# Altium project Timebase board.PrjPcb
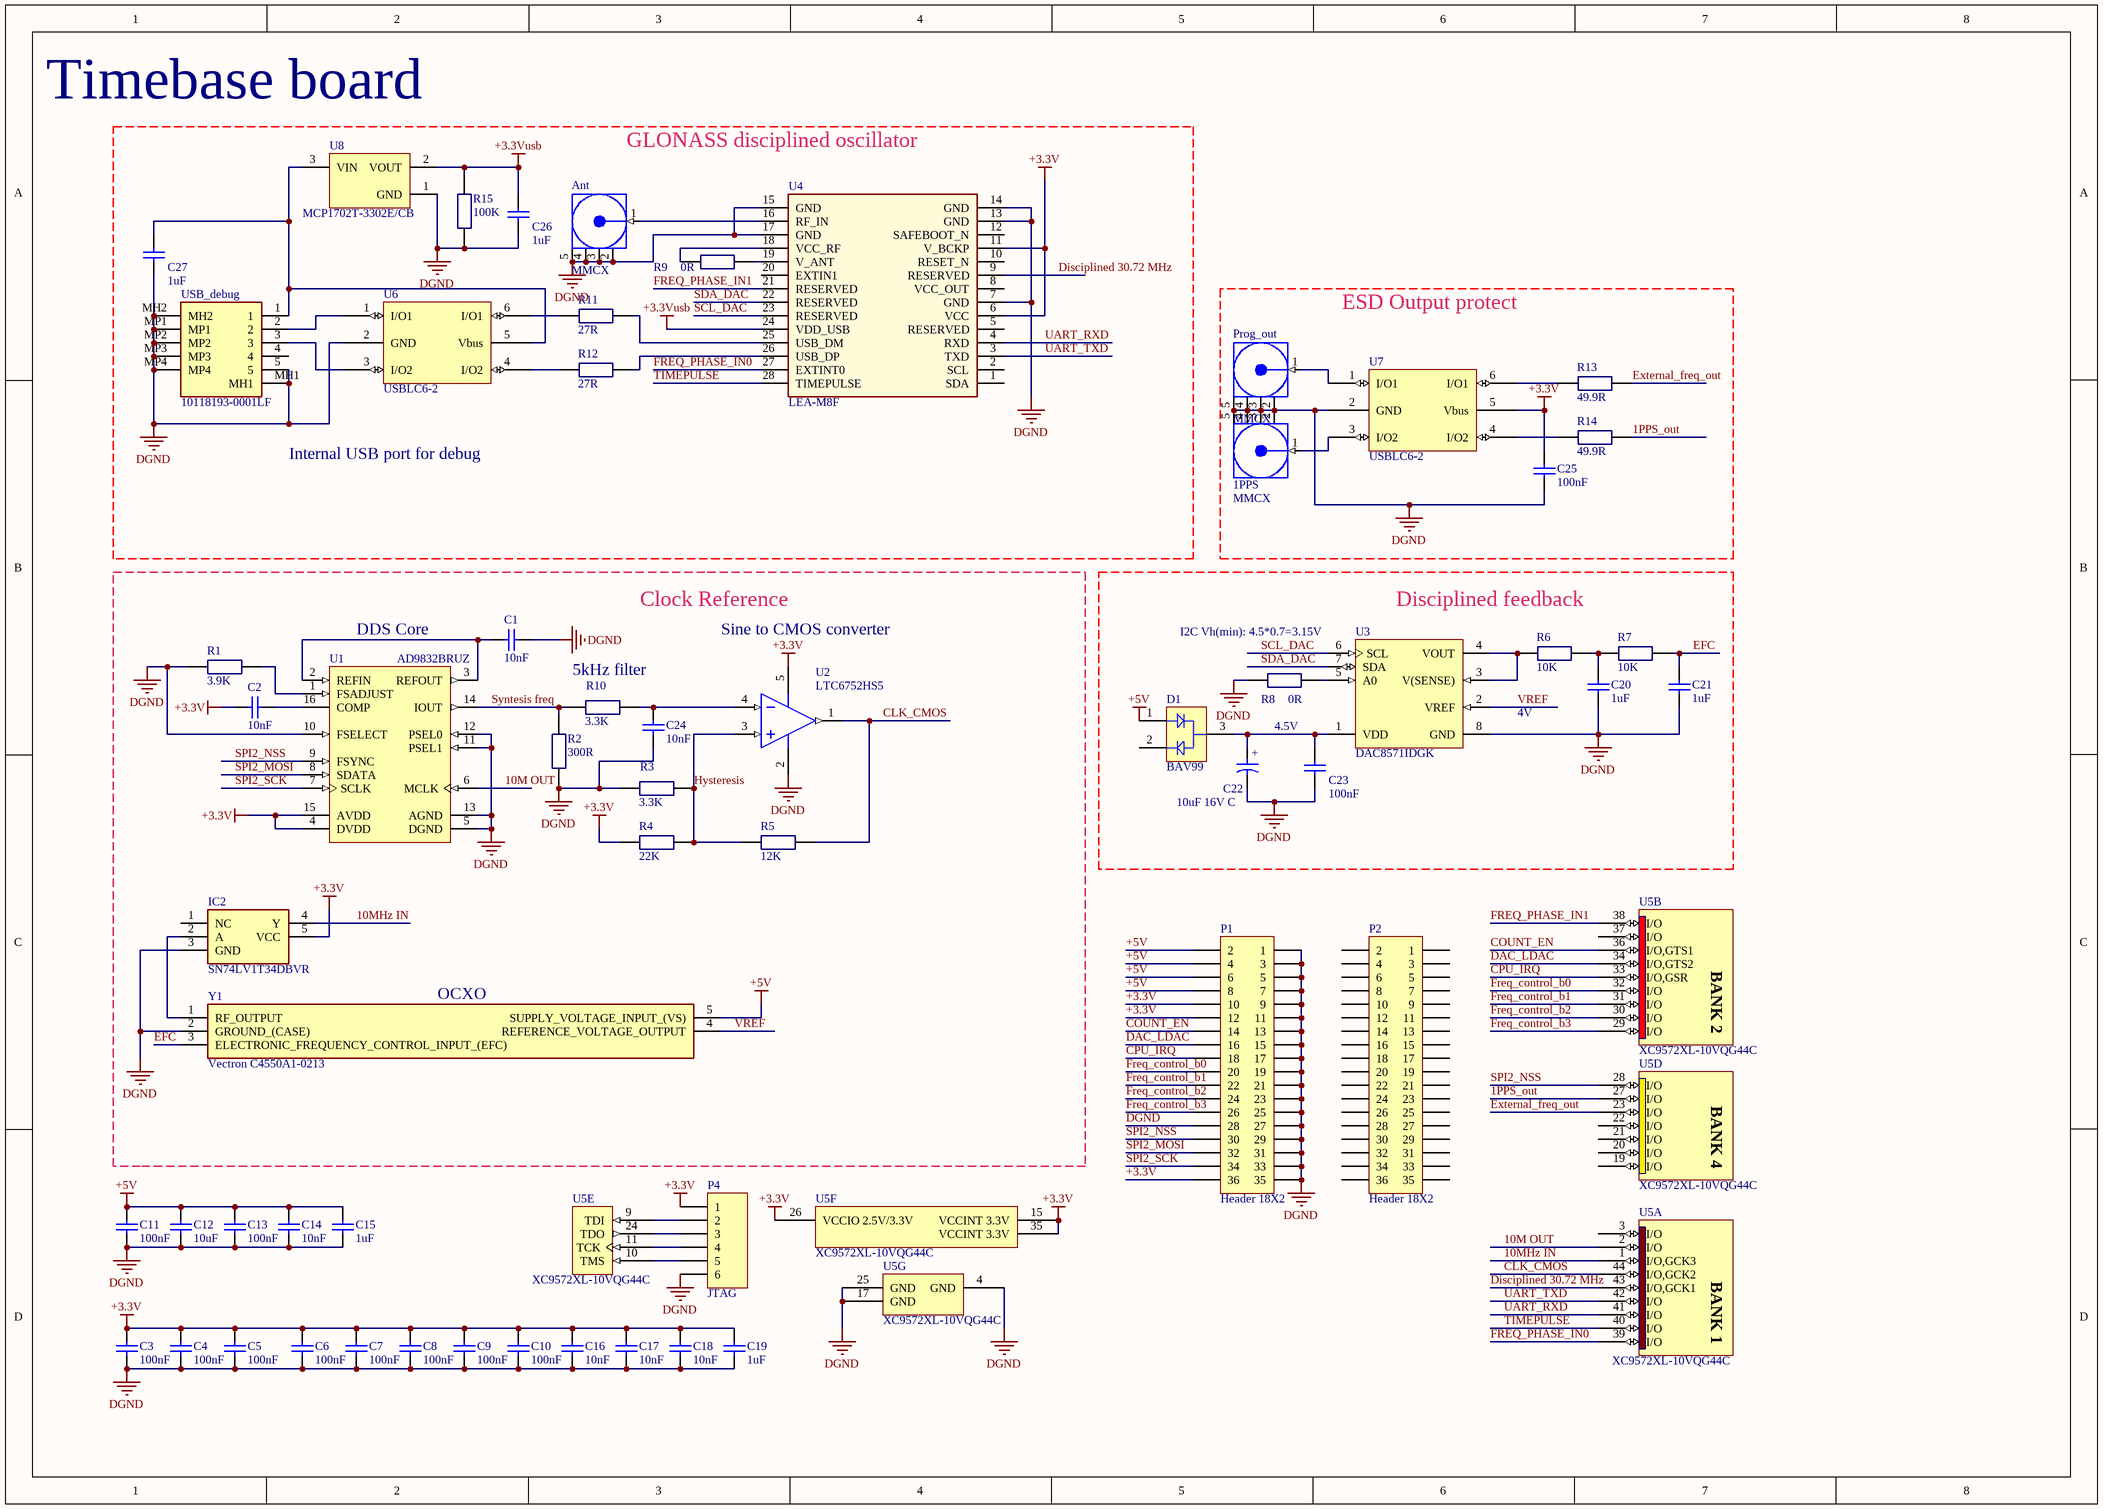
[diagram p0: Timebase_shcematics.SchDoc]
1 sheet, 60 parts. Net scope: global (net labels, ports and power ports of the same name join across sheets).
Board file: Timebase_PCB.PcbDoc

## Sheet Timebase_shcematics.SchDoc: Ultra-Precision low speed ramp generator for low current calibration
size A3; PageSetup: Record=PageOptions|CenterHorizontal=True|CenterVertical=True|PrintScale=0.52|XCorrection=1.00|YCorrection=1.00|PrintKind=0|BorderSize=5000000|LeftOffset=0|BottomOffset=0|Orientation=2|PaperLength=1000|PaperWidth=1000|Scale=100|PaperSource=7|PrintQuality=-3|MediaType=1|DitherType=10|PrintScaleMode=1|PaperKind=A4|PaperIndex=9

### Parts
1PPS  MMCX  [MMCX2.54-V5]
Ant  MMCX  [MMCX2.54-V5]
C1  10nF  [CAP 0603]
C2  10nF  [CAP 0603]
C3  100nF  [CAP 0603]
C4  100nF  [CAP 0603]
C5  100nF  [CAP 0603]
C6  100nF  [CAP 0603]
C7  100nF  [CAP 0603]
C8  100nF  [CAP 0603]
C9  100nF  [CAP 0603]
C10  100nF  [CAP 0603]
C11  100nF  [CAP 0603]
C12  10uF  [CAP 0603]
C13  100nF  [CAP 0603]
C14  10nF  [CAP 0603]
C15  1uF  [CAP 0603]
C16  10nF  [CAP 0603]
C17  10nF  [CAP 0603]
C18  10nF  [CAP 0603]
C19  1uF  [CAP 0603]
C20  1uF  [CAP 0603]
C21  1uF  [CAP 0603]
C22  10uF 16V C  [CAPMP6032X280N]
C23  100nF  [CAP 0603]
C24  10nF  [CAP 0603]
C25  100nF  [CAP 0603]
C26  1uF  [CAP 0603]
C27  1uF  [CAP 0603]
D1  BAV99  [INF-SOT23_N]
IC2  SN74LV1T34DBVR  [SOT95P280X145-5N]
P1  Header 18X2  [HDR2X18]
P2  Header 18X2  [HDR2X18]
P4  JTAG  [HDR1X6]
Prog_out  MMCX  [MMCX2.54-V5]
R1  3.9K  [1608[0603]]
R2  300R  [Yegeo 0603]
R3  3.3K  [Yegeo 0603]
R4  22K  [Yegeo 0603]
R5  12K  [Yegeo 0603]
R6  10K  [1608[0603]]
R7  10K  [1608[0603]]
R8  0R  [1608[0603]]
R9  0R  [1608[0603]]
R10  3.3K  [Yegeo 0603]
R11  27R  [1608[0603]]
R12  27R  [1608[0603]]
R13  49.9R  [1608[0603]]
R14  49.9R  [1608[0603]]
R15  100K  [1608[0603]]
U1  AD9832BRUZ  [ADI-RU-16_N]
U2  LTC6752HS5  [TI-DBV5_N]
U3  DAC8571IDGK  [TI-DGK8_N]
U4  LEA-M8F  [LEA]
U5  XC9572XL-10VQG44C  [VQG44_N]  (parts A,B,D,E,F,G of 7)
U6  USBLC6-2  [SOT23-6L]
U7  USBLC6-2  [SOT23-6L]
U8  MCP1702T-3302E/CB  [SOT-23A-CB3_N]
USB_debug  10118193-0001LF  [101181930001LF]
Y1  Vectron C4550A1-0213  [C4550C508SV120RFSA11128MHZ]

### Blocks framed on the sheet
GLONASS disciplined oscillator: Ant C26 C27 R9 R11 R12 R15 U4 U6 U8 USB_debug
ESD Output protect: 1PPS C25 Prog_out R13 R14 U7
Clock Reference: C1 C2 C24 IC2 R1-R5 R10 U1 U2 Y1
Disciplined feedback: C20-C23 D1 R6-R8 U3

### Nets
+3.3V: C2.1 C3.2 C4.2 C5.2 C6.2 C7.2 C8.2 C9.2 C10.2 C16.2 C17.2 C18.2 C19.2 C25.2 IC2.5(VCC) P1.10 P1.12 P1.36 P4.1 R4.2 U1.4(DVDD) U1.15(AVDD) U2.5(V+) U4.6(VCC) U4.11(V_BCKP) U5.15(VCCINT_3.3V) U5.26(VCCIO_2.5V/3.3V) U5.35(VCCINT_3.3V) U7.5(Vbus)
+3.3Vusb: C26.2 R15.1(A) U4.24(VDD_USB) U8.2(VOUT)
+5V: C11.2 C12.2 C13.2 C14.2 C15.2 D1.1(A1) P1.2 P1.4 P1.6 P1.8 Y1.5(SUPPLY_VOLTAGE_INPUT_(VS))
DGND: 1PPS.2(GND) 1PPS.3(GND) 1PPS.4(GND) 1PPS.5(GND) Ant.2(GND) Ant.3(GND) Ant.4(GND) Ant.5(GND) C1.2 C3.1 C4.1 C5.1 C6.1 C7.1 C8.1 C9.1 C10.1 C11.1 C12.1 C13.1 C14.1 C15.1 C16.1 C17.1 C18.1 C19.1 C20.1 C21.1 C22.2 C23.1 C24.1 C25.1 C26.1 C27.1 IC2.3(GND) P1.1 P1.3 P1.5 P1.7 P1.9 P1.11 P1.13 P1.15 P1.17 P1.19 P1.21 P1.23 P1.25 P1.27 P1.28 P1.29 P1.31 P1.33 P1.35 P4.6 Prog_out.2(GND) Prog_out.3(GND) Prog_out.4(GND) Prog_out.5(GND) R1.2 R2.1(A) R3.2 R8.2 R15.2 U1.5(DGND) U1.10(FSELECT) U1.11(PSEL1) U1.12(PSEL0) U1.13(AGND) U2.2(V-) U3.8(GND) U4.7(GND) U4.13(GND) U4.14(GND) U4.15(GND) U4.17(GND) U5.4(GND) U5.17(GND) U5.25(GND) U6.2(GND) U7.2(GND) U8.1(GND) USB_debug.5 USB_debug.MH1 USB_debug.MH2 USB_debug.MP1 USB_debug.MP2 USB_debug.MP3 USB_debug.MP4 Y1.2(GROUND_(CASE))
1PPS_out: R14.1(A) U5.27(I/O)
10M OUT: U1.6(MCLK) U5.2(I/O)
10MHz IN: IC2.4(Y) U5.1(I/O,GCK3)
CLK_CMOS: R5.1(A) U2.1(OUT) U5.44(I/O,GCK2)
COUNT_EN: P1.14 U5.36(I/O,GTS1)
CPU_IRQ: P1.18 U5.33(I/O,GSR)
DAC_LDAC: P1.16 U5.34(I/O,GTS2)
Disciplined 30.72 MHz: U4.9(RESERVED) U5.43(I/O,GCK1)
EFC: C21.2 R7.1(A) Y1.3(ELECTRONIC_FREQUENCY_CONTROL_INPUT_(EFC))
External_freq_out: R13.1(A) U5.23(I/O)
Freq_control_b0: P1.20 U5.32(I/O)
Freq_control_b1: P1.22 U5.31(I/O)
Freq_control_b2: P1.24 U5.30(I/O)
Freq_control_b3: P1.26 U5.29(I/O)
FREQ_PHASE_IN0: U4.27(EXTINT0) U5.39(I/O)
FREQ_PHASE_IN1: U4.21(RESERVED) U5.38(I/O)
Hysteresis: R3.1(A) R4.1(A) R5.2 U2.3(IN+)
SCL_DAC: U3.6(SCL) U4.23(RESERVED)
SDA_DAC: U3.7(SDA) U4.22(RESERVED)
SPI2_MOSI: P1.32 U1.8(SDATA)
SPI2_NSS: P1.30 U1.9(FSYNC) U5.28(I/O)
SPI2_SCK: P1.34 U1.7(SCLK)
Syntesis freq: R2.2 R10.2 U1.14(IOUT)
TIMEPULSE: U4.28(TIMEPULSE) U5.40(I/O)
UART_RXD: U4.4(RXD) U5.41(I/O)
UART_TXD: U4.3(TXD) U5.42(I/O)
VREF: U3.2(VREF) Y1.4(REFERENCE_VOLTAGE_OUTPUT)
Net1PPS_1: 1PPS.1(Signal) U7.3(I/O2)
NetAnt_1: Ant.1(Signal) U4.16(RF_IN)
NetC1_1: C1.1 U1.2(REFIN) U1.3(REFOUT)
NetC2_2: C2.2 U1.16(COMP)
NetC20_2: C20.2 R6.1(A) R7.2
NetC22_1: C22.1 C23.2 D1.3(C) U3.1(VDD)
NetC24_2: C24.2 R10.1(A) U2.4(IN-)
NetC27_2: C27.2 U6.5(Vbus) U8.3(VIN) USB_debug.1
NetIC2_2: IC2.2(A) Y1.1(RF_OUTPUT)
NetP4_2: P4.2 U5.9(TDI)
NetP4_3: P4.3 U5.24(TDO)
NetP4_4: P4.4 U5.11(TCK)
NetP4_5: P4.5 U5.10(TMS)
NetProg_out_1: Prog_out.1(Signal) U7.1(I/O1)
NetR1_1: R1.1(A) U1.1(FSADJUST)
NetR6_2: R6.2 U3.3(V(SENSE)) U3.4(VOUT)
NetR8_1: R8.1(A) U3.5(A0)
NetR9_1: R9.1(A) U4.19(V_ANT)
NetR9_2: R9.2 U4.18(VCC_RF)
NetR11_1: R11.1(A) U4.25(USB_DM)
NetR11_2: R11.2 U6.6(I/O1)
NetR12_1: R12.1(A) U4.26(USB_DP)
NetR12_2: R12.2 U6.4(I/O2)
NetR13_2: R13.2 U7.6(I/O1)
NetR14_2: R14.2 U7.4(I/O2)
NetU6_1: U6.1(I/O1) USB_debug.2
NetU6_3: U6.3(I/O2) USB_debug.3

Not connected (* = marked no-connect by the designer): D1 2(K2); IC2 1(NC); P2 1 2 3 4 5 6 7 8 9 10 11 12 13 14 15 16 17 18 19 20 21 22 23 24 25 26 27 28 29 30 31 32 33 34 35 36; U4 1(SDA) 2(SCL) 5(RESERVED) 8(VCC_OUT) 10(RESET_N) 12(SAFEBOOT_N) 20(EXTIN1); U5 3(I/O) 19(I/O) 20(I/O) 21(I/O) 22(I/O) 37(I/O); USB_debug 4

### Notes on the sheet
- Timebase board
- Internal USB port for debug
- (near U1) DDS Core
- Sine to CMOS converter
- (near U3) I2C Vh(min): 4.5*0.7=3.15V
- 5kHz filter
- 4V
- 4.5V
- (near Y1) OCXO
- (in symbol CTE6032-28_10UF_25V_10%_LESR0500) +
- (in symbol XC9572XL-10VQG44C, part A) BANK 1
- (in symbol XC9572XL-10VQG44C, part B) BANK 2
- (in symbol XC9572XL-10VQG44C, part D) BANK 4

### Library data of the parts
1PPS Ant Prog_out = COAX-M: RF Coaxial PCB Connector, MMCX; Thru-Hole, Vertical Mount Plug,  50 Ohm Impedance; PackageDocument: Rev. A, 16-Jun-1997; PCB_Layout: Complies with manufacturer's recommendation.; DrillSize: Corresponds to nominal value.; Published: 15-Jul-2004; LatestRevisionDate: 15-Jul-2004; LatestRevisionNote: Component Replaced.; DatasheetDocument: 30-May-2003; PackageReference: 908-21103; Publisher: Altium Limited; ComponentLink1Description: Manufacturer Link; ComponentLink1URL: http://www.amphenolrf.com/
C1-C21 C23-C27 = Cap Semi: Capacitor (Semiconductor SIM Model); Order: CC0603KRX7R8BB104; Published: 8-Jun-2000; LatestRevisionDate: 29-May-2009; LatestRevisionNote: IPC-7351 Footprint Added.; PackageReference: C1206; Publisher: Altium Limited; PackageDescription: Chip Capacitor
  C1 C2 C14 C16-C18 C24: Value: 10nF
  C3-C11 C13 C23 C25: Value: 100nF
  C12: Value: 10uF
  C15 C19-C21 C26 C27: Value: 1uF
C22 = CTE6032-28_10UF_25V_10%_LESR0500: Polarised capacitor; Part Description: Low ESR 0R5 Solid Tantalum Chip Capacitor; Manufacturer: GENERIC; Manufacturer1 Part Number: TPSC106K025R0500; Voltage: 25V; Tolerance: ±10%; Part Number: CTE6032-28_10UF_25V_10%_LESR0500; Component Kind: Standard; Component Type: Standard; Pin Count: 2; Value: 10uF 16V C; Status: Preferred; Manufacturer Part Number: CTE6032-28_10UF_25V_10%_LESR0500; Case: C; Mounted: Yes; Socket: No; SMD: Yes; Sense: No; Manufacturer1 Example: AVX; Manufacturer1 ComponentHeight: 2.8mm; HelpURL: \\cern.ch\dfs\Applications\Altium\Datasheets\CTE-LESR_AVX_TPS.pdf; Author: CERN DEM JLC; CreateDate: 05.05.2008; LatestRevisionDate: 20.01.2009
D1 = BAV99: Silicon Switching Diode, SOT23, Reel, Green; Manufacturer: Infineon; Green: TRUE; PackageVersion: Apr-08; PackageReference: SOT23; PackageDescription: 3-Pin Small Outline Transistor Package, 1.3 x 2.9 mm Body, 0.95 mm Pitch; Supplier 1: Arrow; Supplier Part Number 1: 8_hDx09NysxyY_EZJdaSbs5L1p9U5ut-2MaZMQWGOaA; Supplier 2: Farnell; Supplier Part Number 2: 1056504RL; Supplier 3: Farnell; Supplier Part Number 3: 1056504; Packing: Reel; Mounting Technology: Surface Mount; PartNumber: BAV99; ComponentLink1Description: Manufacturer URL; ComponentLink1URL: http://www.infineon.com/; ComponentLink2Description: Datasheet; ComponentLink2URL: http://www.infineon.com/dgdl/bav99series.pdf?folderId=db3a30431400ef6801141b5844e103ea&fileId=db3a30431400ef6801141c1b237d042f; ComponentLink3Description: Package Specification; ComponentLink3URL: http://www.infineon.com/dgdl/smbta14_mmbta14.pdf?folderId=db3a30431441fb5d011445c30f210183&fileId=db3a30431441fb5d011445ef0201018c
IC2 = SN74LV1T34DBVR: Integrated Circuit; Manufacturer_Name: Texas Instruments; Datasheet Link: http://www.ti.com/lit/gpn/sn74lv1t34; Height: 1.45mm; Manufacturer_Part_Number: SN74LV1T34DBVR; Mouser Part Number: 595-SN74LV1T34DBVR; Mouser Price/Stock: https://www.mouser.co.uk/ProductDetail/Texas-Instruments/SN74LV1T34DBVR?qs=8sOby8ZxZLE4ekkxA3S6Wg%3D%3D; Arrow Part Number: SN74LV1T34DBVR; Arrow Price/Stock: https://www.arrow.com/en/products/sn74lv1t34dbvr/texas-instruments?region=nac
P1 P2 = Header 18X2: Header, 18-Pin, Dual row; System: Connector; LatestRevisionDate: 17-Jul-2002; LatestRevisionNote: Re-released for DXP Platform.; Publisher: Altium Limited
P4 = Header 6: Header, 6-Pin; LatestRevisionDate: 17-Jul-2002; LatestRevisionNote: Re-released for DXP Platform.; Publisher: Altium Limited
R1-R5 R10 = Resistor 0805: Order: ERA-3AEB49R9V; Avail: 20
  R1: Value: 3.9K
  R2: Value: 300R
  R3 R10: Value: 3.3K
  R4: Value: 22K
  R5: Value: 12K
R6-R9 R11-R15 = Resistor 0805: Order: CR0603-JW-220GLF; Avail: 20
  R6 R7: Value: 10K
  R8 R9: Value: 0R
  R11 R12: Value: 27R
  R13 R14: Value: 49.9R
  R15: Value: 100K
U1 = AD9832BRUZ: 25 MHz Direct Digital Synthesizer, Waveform Generator, 10-Bit, Serial, RU-16, 96 Tube, Pb-Free; Master fclk: 25MHz; Resolution (Bits): 10bit; Tuning Word Width (bits): 32bit; REFCLK Multiplier: No; Compliance Range (V): 1.35V; FS Iout (mA nom): 4mA; I Supply total (max): 15mA; DatasheetVersion: Rev. C; PackageVersion: Nov-2002; PackageReference: RU-16; PackageDescription: 16-Lead Thin Shrink Small Outline Package [TSSOP]; I/O Interface: Serial; Code_JEDEC: MO-153AB; ComponentLink1Description: Manufacturer URL; ComponentLink1URL: www.analog.com; ComponentLink2Description: Datasheet; ComponentLink2URL: http://www.analog.com/static/imported-files/data_sheets/AD9832.pdf; ComponentLink3Description: Package Specification; ComponentLink3URL: http://www.analog.com/static/imported-files/packages/36244347913743854010197452789RU16.pdf
U2 = OPA353NA/250: High-Speed, Single-Supply, Rail-to-Rail Operational Amplifier MicroAmplifier(TM) Series, 2.7 to 5.5 V, -40 to 85 degC, 5-pin SOT23 (DBV5), Green (RoHS & no Sb/Br); Manufacturer: Texas Instruments; CMRR(Min)(dB): 76; GBW(Typ)(MHz): 44; IIB(Max)(pA): 10; Iq per channel(Max)(mA): 8; Number of Channels: 1; Offset Drift(Typ)(uV/C): 5; Packing: SMALL T&R; Rating: Catalog; Slew Rate(Typ)(V/us): 22; Sub Family: High Output Current Amplifier (>=50mA), Low Input Bias Current Amp (<=10pA), Low Supply Voltage Amplifier (<=2.7V), Precision Amplifier; Total Supply Voltage(Max)(+5V is 5, +/-5V is 10): 5.5; Total Supply Voltage(Min)(+5V is 5, +/-5V is 10): 2.7; DatasheetVersion: SBOS103; PackageVersion: 4073253-4/K, 03/2006; PackageReference: DBV5; PackageDescription: 5-Pin Plastic Small Outline, Body 1.6 x 2.9 mm, Pitch 0.95 mm; Supplier 1: Digi-Key; Supplier Part Number 1: OPA353NATR-ND; Supplier 2: Digi-Key; Supplier Part Number 2: OPA353NACT-ND; Supplier 3: Digi-Key; Supplier Part Number 3: OPA353NADKR-ND; Supplier 4: Farnell; Supplier Part Number 4: 1207049; Supplier 5: Farnell; Supplier Part Number 5: 1207049RL; Supplier 6: Newark; Supplier Part Number 6: 35C1895; Supplier 7: Mouser; Supplier Part Number 7: 595-OPA353NA/250; Eco-Plan: Green (RoHS & no Sb/Br); Vio (25C)(Max)(mV): 8; Mounting Technology: Surface Mount; Code_JEDEC: MO-178; PartNumber: OPA353NA/250; ComponentLink1Description: Manufacturer URL; ComponentLink1URL: http://www.ti.com/; ComponentLink2Description: Datasheet; ComponentLink2URL: http://www.ti.com/lit/ds/symlink/opa353.pdf; ComponentLink3Description: Package Specification; ComponentLink3URL: http://www.ti.com/litv/pdf/mpds018i
U3 = DAC8571IDGK: Low-Power Rail-to-Rail Output 16-Bit I2C Input DAC, -40 to 105 degC, 8-pin SOP (DGK8), Green (RoHS & no Sb/Br); Manufacturer: Texas Instruments; DAC Channels: 1; INL(Max)(+/-LSB): 65; Interface: Serial I2C; Power Consumption(Typ)(mW): 0.42; Resolution(Bits): 16; Settling Time(us): 8; SubFamily: Precision DAC (=<10MSPS); DatasheetVersion: SLAS373A; PackageVersion: 4073329/E, 05/2006; PackageReference: DGK8; PackageDescription: 8-Pin Thin Small Outline, Body 3 x 3 mm, Pitch 0.65 mm; Supplier 1: Digi-Key; Supplier Part Number 1: 296-26051-5-ND; Supplier 2: Newark; Supplier Part Number 2: 20H5068; Supplier 3: Mouser; Supplier Part Number 3: 595-DAC8571IDGK; DNL(Max)(+/-LSB): 1; Eco-Plan: Green (RoHS & no Sb/Br); Mounting Technology: Surface Mount; Code_JEDEC: MO-187; PartNumber: DAC8571IDGK; ComponentLink1Description: Manufacturer URL; ComponentLink1URL: http://www.ti.com/; ComponentLink2Description: Datasheet; ComponentLink2URL: http://www.ti.com/general/docs/lit/getliterature.tsp?genericPartNumber=DAC8571&fileType=pdf; ComponentLink3Description: Package Specification; ComponentLink3URL: http://www.ti.com/litv/pdf/mpds028d
U4 = LEA: u-blox LEA GNSS module; Part Description: u-blox LEA-M8 GNSS module; Manufacturer: u-blox; Value: LEA-M8F
U5 = XC9572XL-10VQG44C: FastFLASH XC900XL, 3.3V High-Performance 72 Macrocell CPLD, 34 User I/Os, 44-Pin VQFP, Speed Grade 10, Commercial Grade, Pb-Free; Published: 8-Sep-2006; LatestRevisionDate: 18-Nov-2009; LatestRevisionNote: Updated to datasheet version 2.5 May-2009.; DatasheetVersion: ver2.0 Apr-2007; PackageVersion: ver1.2, Jun-2004; PackageReference: VQG44; Publisher: Altium Limited; PackageDescription: 44-Pin Very Thin Quad Flat Pack (VQG44) - Pb-Free; Supplier 1: Digi-Key; Supplier Part Number 1: 122-1448-ND; Supplier 2: Farnell; Supplier Part Number 2: 1605849; Supplier 3: Newark; Supplier Part Number 3: 12N2472; Code_JEDEC: MS-026-ACB; ComponentLink1Description: XC9572XL Datasheet; ComponentLink1URL: http://www.xilinx.com/support/documentation/data_sheets/ds057.pdf; ComponentLink2Description: VQG44 Package Drawing; ComponentLink2URL: http://www.xilinx.com/support/documentation/package_specs/vq44.pdf; ComponentLink3Description: XC9500XL Documents; ComponentLink3URL: http://www.xilinx.com/support/documentation/xc9500xl.htm; ComponentLink4Description: Xilinx.com Home; ComponentLink4URL: http://www.xilinx.com
U6 U7 = USBLC6-2: Avail: 1; Order: USBLC6-2
U8 = MCP1702T-3302E/CB: 250 mA Low Quiescent Current LDO Regulator, 3-Pin SOT-23A, Extended Temperature, Tape and Reel; Published: 29-Jan-2009; LatestRevisionDate: 02-Dec-2009; LatestRevisionNote: Updated to datasheet revision D, Jun-2009; DatasheetVersion: revD, Jun-2009; PackageVersion: revBB, Aug-2009; PackageReference: SOT-23A-CB3; Publisher: Altium Limited; PackageDescription: 3-Lead Plastic Small Outline Transistor (CB) [SOT-23A]; Supplier 1: Digi-Key; Supplier Part Number 1: MCP1702T-3302E/CBTR-ND; Supplier 2: Digi-Key; Supplier Part Number 2: MCP1702T-3302E/CBCT-ND; Supplier 3: Digi-Key; Supplier Part Number 3: MCP1702T-3302E/CBDKR-ND; Supplier 4: Farnell; Supplier Part Number 4: 1331490; ComponentLink1Description: Datasheet; ComponentLink1URL: http://ww1.microchip.com/downloads/en/DeviceDoc/22008d.pdf; ComponentLink2Description: Packaging Specification; ComponentLink2URL: http://www.microchip.com/stellent/groups/techpub_sg/documents/packagingspec/en012702.pdf; ComponentLink3Description: Microchip.com Home; ComponentLink3URL: http://www.microchip.com/
USB_debug = 10118193-0001LF: Connector; Manufacturer_Name: Amphenol; Datasheet Link: https://datasheet.datasheetarchive.com/originals/distributors/Datasheets_SAMA/035be5b62fc6b7a9cadde58b72893b5e.pdf; Height: 3.1mm; Manufacturer_Part_Number: 10118193-0001LF; Mouser Part Number: 649-10118193-0001LF; Mouser Price/Stock: https://www.mouser.co.uk/ProductDetail/Amphenol-FCI/10118193-0001LF?qs=Ywefl8B65e63Nsqd%252B8HZaQ%3D%3D; Arrow Part Number: 10118193-0001LF; Arrow Price/Stock: https://www.arrow.com/en/products/10118193-0001lf/amphenol-fci?region=nac
Y1 = C4550C508SV120RFSA1112.8MHZ: Crystal or Oscillator; Height: 11.25mm; Manufacturer_Name: Vectron; Manufacturer_Part_Number: Vectron C4550A1-0213